# EAGLE design CitizenBoard V3.2 (EAGLE 6.5.0)
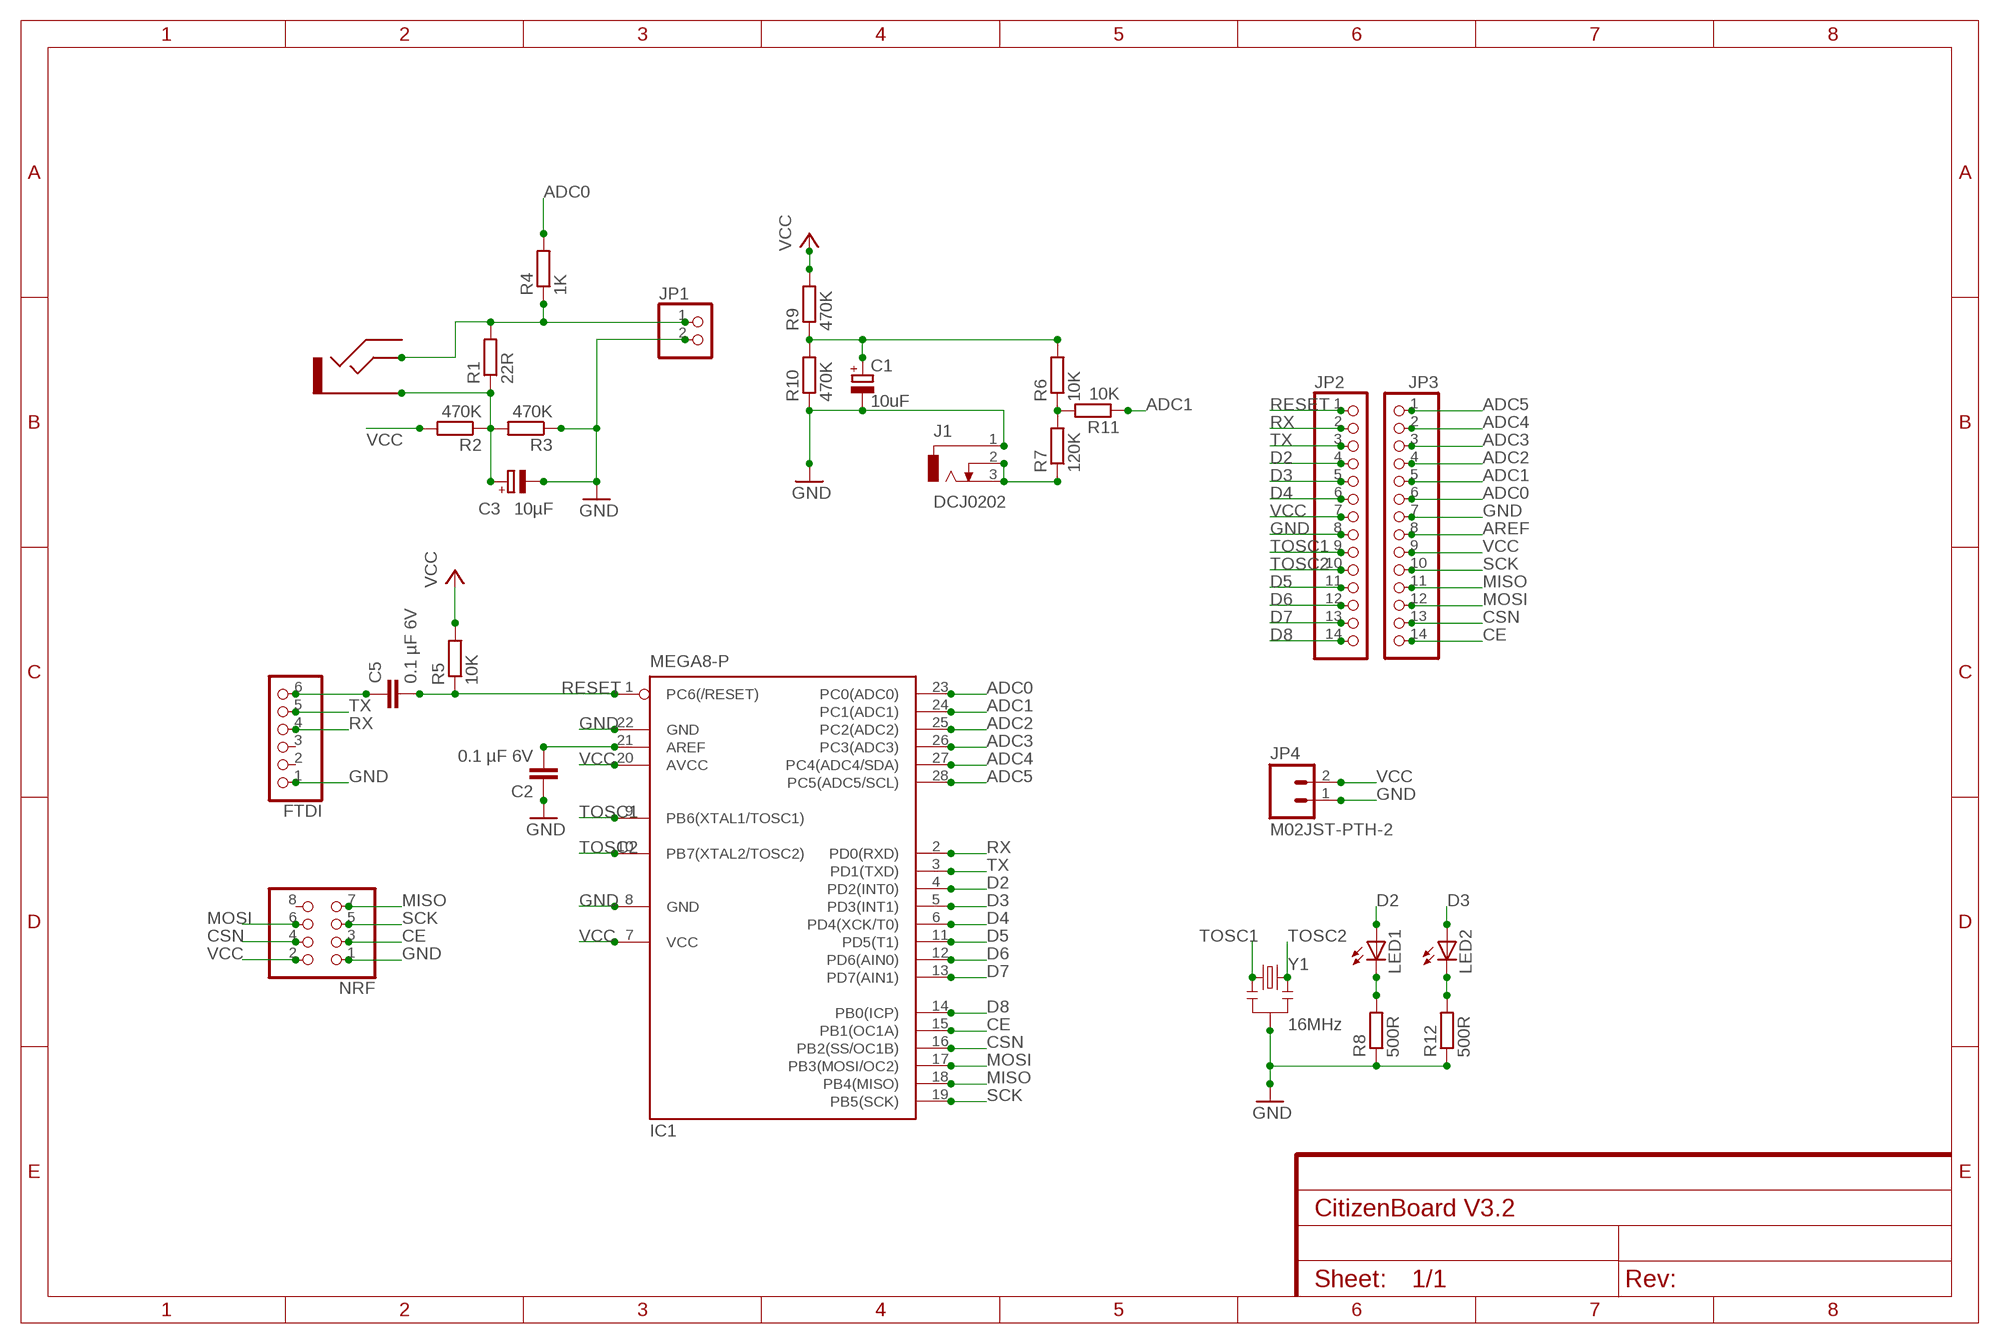
[diagram p0: schematic, sheet 1]

## Parts
C1  10uF  CPOL-EUE2,5-6E  [E2,5-6E]
C2  0.1 µF 6V  C-EU025-024X044  [C025-024X044]
C3  10µF  CPOL-EUE2,5-6E  [E2,5-6E]
C5  0.1 µF 6V  C-EU025-024X044  [C025-024X044]
FTDI  PINHD-1X6  [1X06]
IC1  MEGA8-P  [DIL28-3]
J1  DCJ0202  [DCJ0202]
J2  AUDIO-JACK-3.5  [AUDIO-JACK-3.5]
JP1  PINHD-1X2  [1X02]
JP2  PINHD-1X14  [1X14]
JP3  PINHD-1X14  [1X14]
JP4  M02JST-PTH-2  [JST-2-PTH]
LED1  LED3MM  [LED3MM]
LED2  LED3MM  [LED3MM]
NRF  PINHD-2X4  [2X04]
R1  22R  R-EU_0204/7  [0204/7]
R2  470K  R-EU_0204/7  [0204/7]
R3  470K  R-EU_0204/7  [0204/7]
R4  1K  R-EU_0204/7  [0204/7]
R5  10K  R-EU_0204/7  [0204/7]
R6  10K  R-EU_0204/7  [0204/7]
R7  120K  R-EU_0204/7  [0204/7]
R8  500R  R-EU_0204/7  [0204/7]
R9  470K  R-EU_0204/7  [0204/7]
R10  470K  R-EU_0204/7  [0204/7]
R11  10K  R-EU_0204/7  [0204/7]
R12  500R  R-EU_0204/7  [0204/7]
Y1  16MHz  RESONATORPTH  [RESONATOR-PTH]

## Nets
ADC0: IC1.23(PC0(ADC0)) JP3.6 R4.2
ADC1: IC1.24(PC1(ADC1)) JP3.5 R11.1
ADC2: IC1.25(PC2(ADC2)) JP3.4
ADC3: IC1.26(PC3(ADC3)) JP3.3
ADC4: IC1.27(PC4(ADC4/SDA)) JP3.2
ADC5: IC1.28(PC5(ADC5/SCL)) JP3.1
AREF: C2.2 IC1.21(AREF) JP3.8
CE: IC1.15(PB1(OC1A)) JP3.14 NRF.3
CSN: IC1.16(PB2(SS/OC1B)) JP3.13 NRF.4
D2: IC1.4(PD2(INT0)) JP2.4 LED1.A
D3: IC1.5(PD3(INT1)) JP2.5 LED2.A
D4: IC1.6(PD4(XCK/T0)) JP2.6
D5: IC1.11(PD5(T1)) JP2.11
D6: IC1.12(PD6(AIN0)) JP2.12
D7: IC1.13(PD7(AIN1)) JP2.13
D8: IC1.14(PB0(ICP)) JP2.14
GND: C1.- C2.1 C3.- FTDI.1 IC1.8(GND) IC1.22(GND) J1.1 JP1.2 JP2.8 JP3.7 JP4.1 NRF.1 R3.1 R8.1 R10.1 R12.1 Y1.2
MISO: IC1.18(PB4(MISO)) JP3.11 NRF.7
MOSI: IC1.17(PB3(MOSI/OC2)) JP3.12 NRF.6
N: J2.5T(L) JP1.1 R1.2 R4.1
N$1: R6.1 R7.2 R11.2
N$2: LED2.K(C) R12.2
N$3: C5.1 FTDI.6
N$4: C3.+ J2.1S(GND) R1.1 R2.1 R3.2
N$5: LED1.K(C) R8.2
N$8: J1.2 J1.3 R7.1
N$11: C1.+ R6.2 R9.1 R10.2
RESET: C5.2 IC1.1(PC6(/RESET)) JP2.1 R5.1
RX: FTDI.4 IC1.2(PD0(RXD)) JP2.2
SCK: IC1.19(PB5(SCK)) JP3.10 NRF.5
TOSC1: IC1.9(PB6(XTAL1/TOSC1)) JP2.9 Y1.1
TOSC2: IC1.10(PB7(XTAL2/TOSC2)) JP2.10 Y1.3
TX: FTDI.5 IC1.3(PD1(TXD)) JP2.3
VCC: IC1.7(VCC) IC1.20(AVCC) JP2.7 JP3.9 JP4.2 NRF.2 R2.2 R5.2 R9.2
Unconnected: FTDI.2 FTDI.3 J2.2R(R) NRF.8

## Library data of the parts
C1 C3 = rcl:CPOL-EU: POLARIZED CAPACITOR, European symbol
C2 C5 = rcl:C-EU: CAPACITOR, European symbol
FTDI = pinhead:PINHD-1X6: PIN HEADER
IC1 = atmel:MEGA8-P: MICROCONTROLLER 8 Kbytes FLASH, 1 kbytes SRAM, 512 bytes EEPROM, USART, 4-channel 10 bit ADC, 2-channel 8 bit ADC Pin compatible with Atmega48, ATMega88, ATMega168 Source: avr.lbr; OC_FARNELL: unknown; OC_NEWARK: unknown
J1 = con-jack:DCJ0202: DC POWER JACK Source: DCJ0202.pdf; OC_FARNELL: unknown; OC_NEWARK: unknown
J2 = alex:AUDIO-JACK-3.5: Mouser Jack 3"5
JP1 = pinhead:PINHD-1X2: PIN HEADER
JP2 JP3 = pinhead:PINHD-1X14: PIN HEADER
JP4 = SparkFun-Connectors:M02: Standard 2-pin 0.1" header. Use with - straight break away headers ( PRT-00116) - right angle break away headers (PRT-00553) - swiss pins (PRT-00743) - machine pins (PRT-00117) - female headers (PRT-00115) Molex polarized connector foot print use with: PRT-08233 with associated crimp pins and housings. 2.54_SCREWTERM for use with PRT-10571. 3.5mm Screw Terminal footprints for PRT-08084 5mm Screw Terminal footprints for use with PRT-08433; SKU: PRT-09914
LED1 LED2 = led:LED: LED OSRAM: - CHIPLED LG R971, LG N971, LY N971, LG Q971, LY Q971, LO R971, LY R971 LH N974, LH R974 LS Q976, LO Q976, LY Q976 LO Q996 - Hyper CHIPLED LW Q18S LB Q993, LB Q99A, LB R99A - SideLED LS A670, LO A670, LY A670, LG A670, LP A670 LB A673, LV A673, LT A673, LW A673 LH A674 LY A675 LS A676, LA A676, LO A676, LY A676, LW A676 LS A679, LY A679, LG A679 - Hyper Micro SIDELED® LS Y876, LA Y876, LO Y876, LY Y876 LT Y87S - SmartLED LW L88C, LW L88S LB L89C, LB L89S, LG L890 LS L89K, LO L89K, LY L89K LS L896, LA L896, LO L896, LY L896 - TOPLED LS T670, LO T670, LY T670, LG T670, LP T670 LSG T670, LSP T670, LSY T670, LOP T670, LYG T670 LG T671, LOG T671, LSG T671 LB T673, LV T673, LT T673, LW T673 LH T674 LS T676, LA T676, LO T676, LY T676, LB T676, LH T676, LSB T676, LW T676 LB T67C, LV T67C, LT T67C, LS T67K, LO T67K, LY T67K, LW E67C LS E67B, LA E67B, LO E67B, LY E67B, LB E67C, LV E67C, LT E67C LW T67C LS T679, LY T679, LG T679 LS T770, LO T770, LY T770, LG T770, LP T770 LB T773, LV T773, LT T773, LW T773 LH T774 LS E675, LA E675, LY E675, LS T675 LS T776, LA T776, LO T776, LY T776, LB T776 LHGB T686 LT T68C, LB T68C - Hyper Mini TOPLED® LB M676 - Mini TOPLED Santana® LG M470 LS M47K, LO M47K, LY M47K Source: http://www.osram.convergy.de LUXEON: - LUMILED® LXK2-PW12-R00, LXK2-PW12-S00, LXK2-PW14-U00, LXK2-PW14-V00 LXK2-PM12-R00, LXK2-PM12-S00, LXK2-PM14-U00 LXK2-PE12-Q00, LXK2-PE12-R00, LXK2-PE12-S00, LXK2-PE14-T00, LXK2-PE14-U00 LXK2-PB12-K00, LXK2-PB12-L00, LXK2-PB12-M00, LXK2-PB14-N00, LXK2-PB14-P00, LXK2-PB14-Q00 LXK2-PR12-L00, LXK2-PR12-M00, LXK2-PR14-Q00, LXK2-PR14-R00 LXK2-PD12-Q00, LXK2-PD12-R00, LXK2-PD12-S00 LXK2-PH12-R00, LXK2-PH12-S00 LXK2-PL12-P00, LXK2-PL12-Q00, LXK2-PL12-R00 Source: www.luxeon.com KINGBRIGHT: KA-3528ASYC Source: www.kingbright.com
NRF = pinhead:PINHD-2X4: PIN HEADER
R1-R12 = rcl:R-EU_: RESISTOR, European symbol
Y1 = SparkFun-FreqCtrl:RESONATOR: Resonator Small SMD resonator. Used, eg, on the Arduino Pro/ Pro Mini boards. 8MHz- XTAL-08895 16MHz- XTAL-08900

## Board
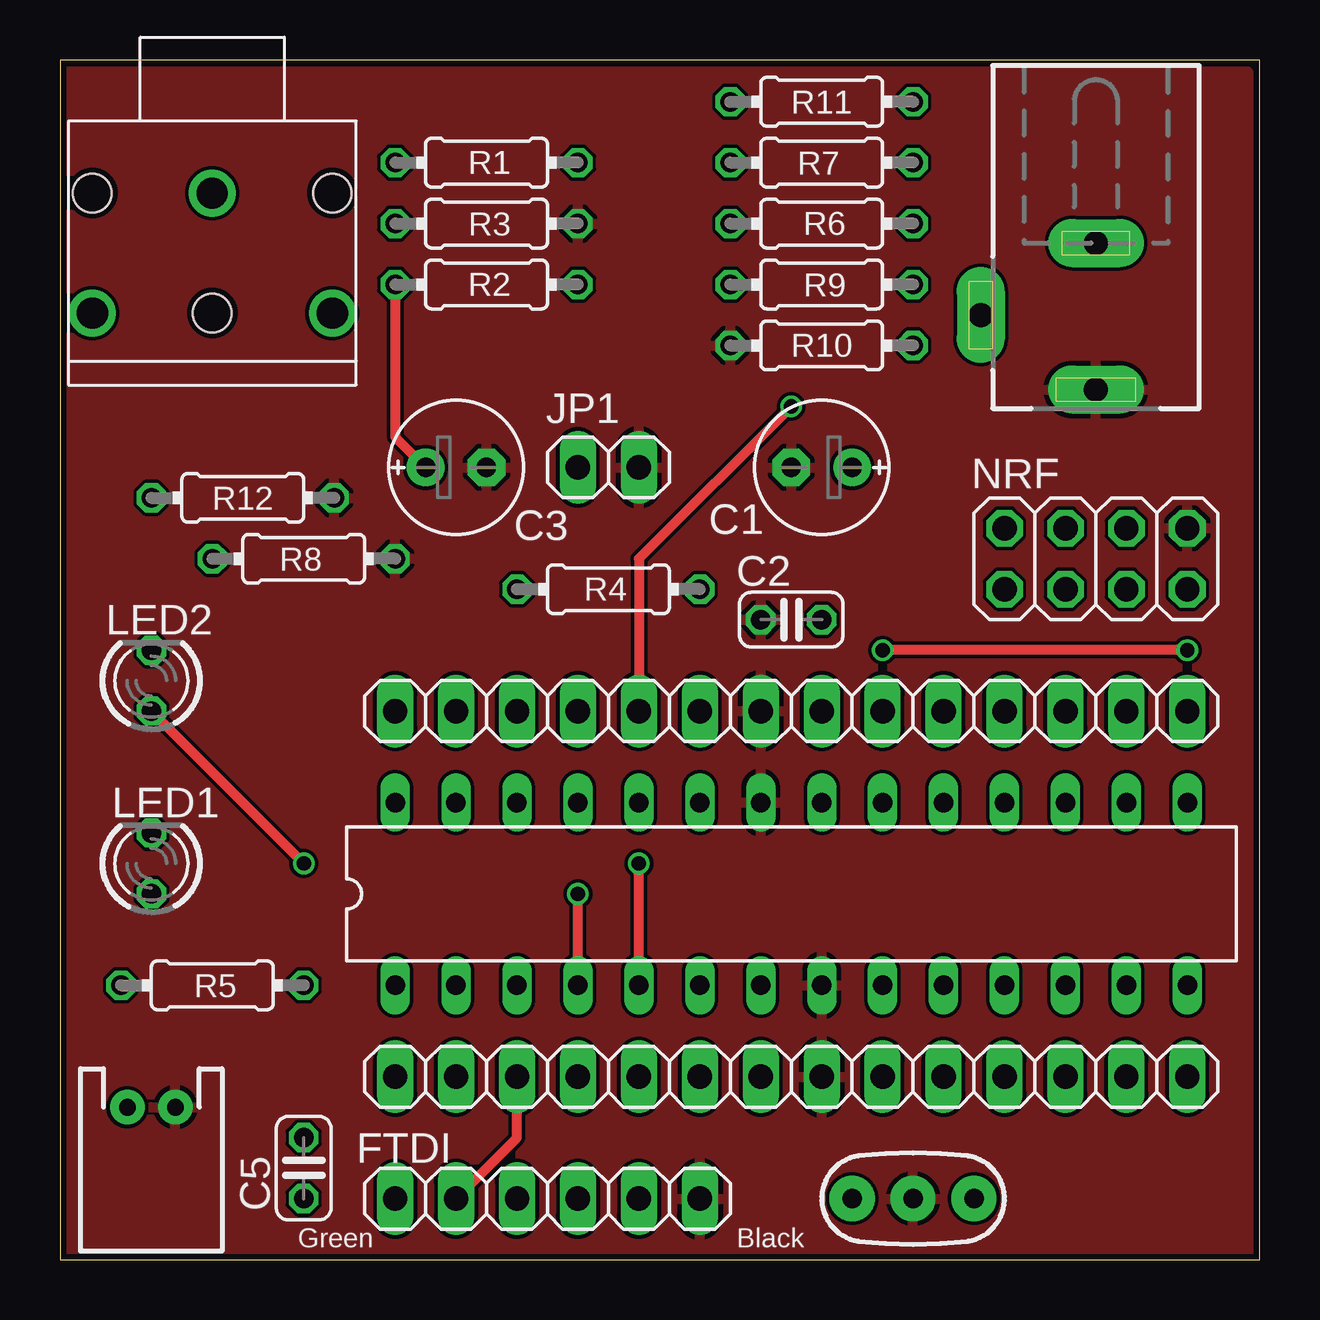
[diagram p1: board, top side]
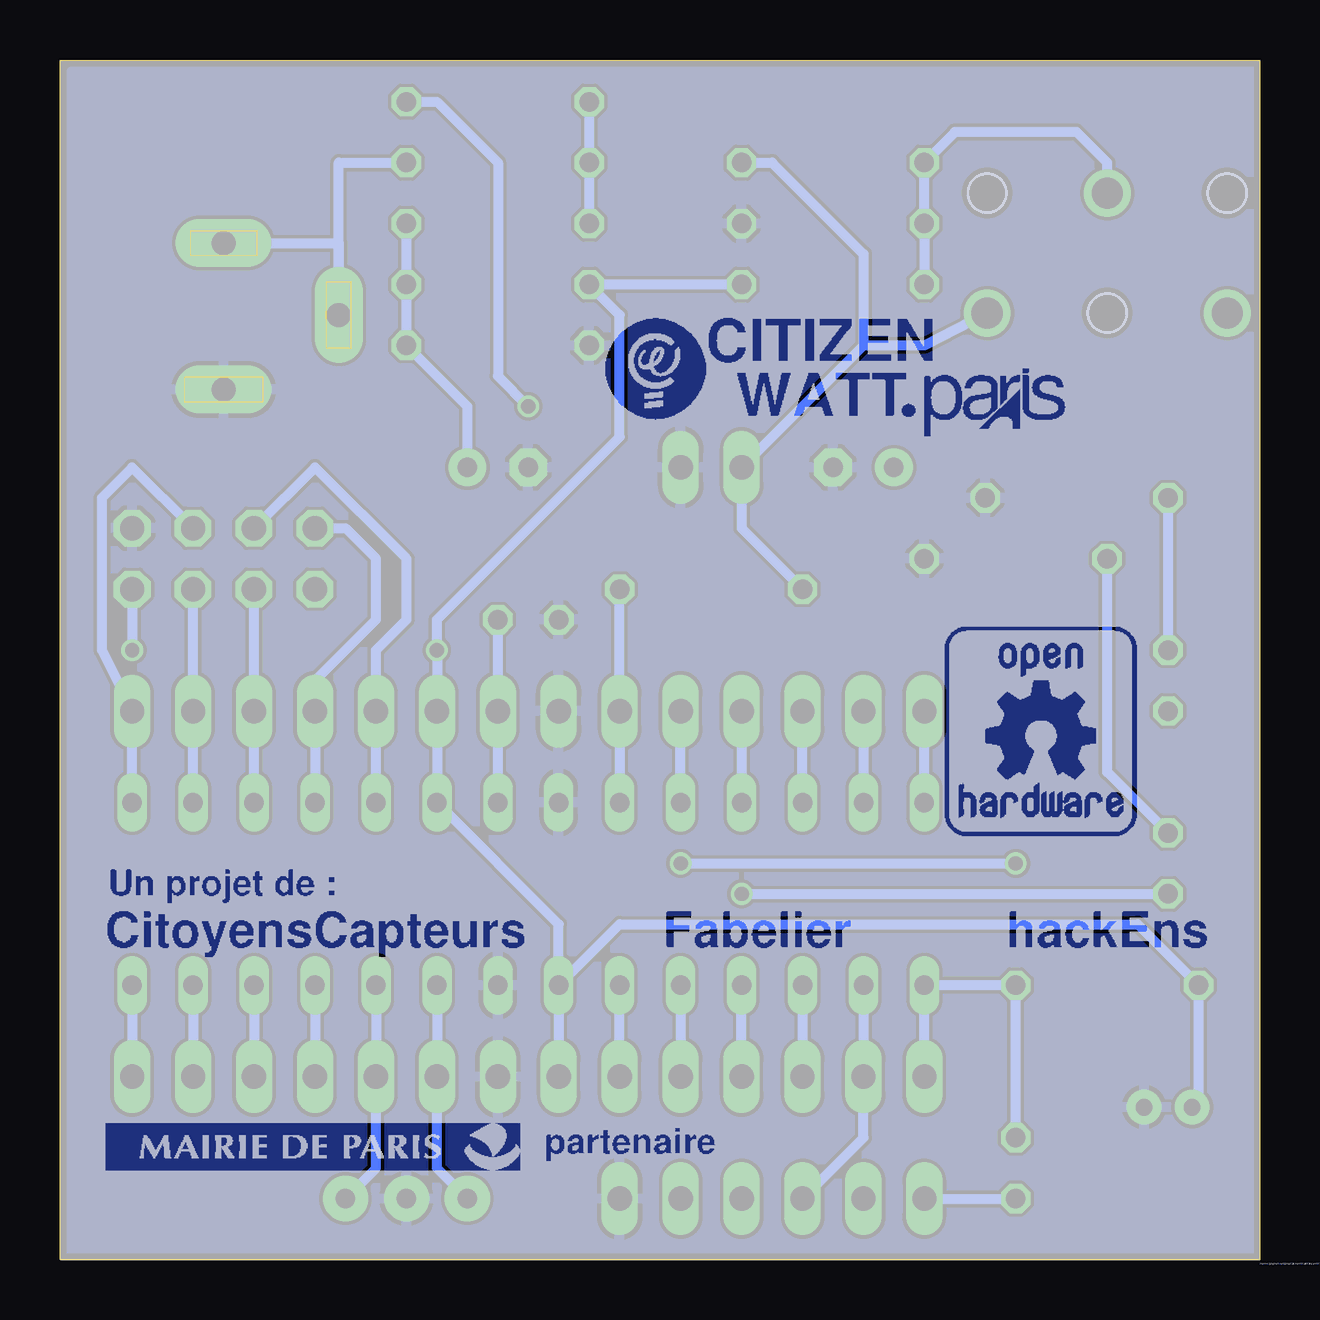
[diagram p2: board, bottom side, seen from below]

Size 50 x 50 mm. Coordinates in mm from the lower left corner, seen from the top.
Outline: 0,0 50,0 50,50 0,50 0,0
Copper layers (1*16): Top 0.018mm / dielectric 1.55mm / Bottom 0.018mm
Design rules "eC_2Layer_PClass6_BaseCopperO18_eCDefault": minimum track width 0.15mm, minimum drill 0.35mm, track to track 0.15mm, track to pad 0.15mm, pad to pad 0.15mm, via to via 0.15mm, smd to smd 0mil, copper to edge 0.25mm, drill to drill 0.35mm, minimum pad ring 0.175mm, minimum via ring 0.125mm, stop-mask expansion 0mil, vias tented up to drill 0.45mm, thermal gap 0.2mm

### Footprints (pad centres in the part's own frame; a part is rotated, then mirrored left to right if it is on the bottom)
E2,5-6E = drill 0.813 pad 1.575: + -1.27,0 | drill 0.813 pad 1.575 octagon: - 1.27,0
C025-024X044 = drill 0.813 octagon: 1 -1.27,0; 2 1.27,0
1X06 = drill 1.016 long: 1 -6.35,0; 2 -3.81,0; 3 -1.27,0; 4 1.27,0; 5 3.81,0; 6 6.35,0
DIL28-3 = drill 0.813 long: 1 -16.51,-3.81; 2 -13.97,-3.81; 3 -11.43,-3.81; 4 -8.89,-3.81; 5 -6.35,-3.81; 6 -3.81,-3.81; 7 -1.27,-3.81; 8 1.27,-3.81; 9 3.81,-3.81; 10 6.35,-3.81; 11 8.89,-3.81; 12 11.43,-3.81; 13 13.97,-3.81; 14 16.51,-3.81; 15 16.51,3.81; 16 13.97,3.81; 17 11.43,3.81; 18 8.89,3.81; 19 6.35,3.81; 20 3.81,3.81; 21 1.27,3.81; 22 -1.27,3.81; 23 -3.81,3.81; 24 -6.35,3.81; 25 -8.89,3.81; 26 -11.43,3.81; 27 -13.97,3.81; 28 -16.51,3.81
DCJ0202 = drill 1 pad 2 long: 1 0,3.1; 2 4.8,0; 3 0,-3
AUDIO-JACK-3.5 = drill 1.3: 1S 0,0; 2R 5,-5; 5T 5,5 | hole 1.6: 0,-5; 5,0; 0,5
1X02 = drill 1.016 long: 1 -1.27,0; 2 1.27,0
1X14 = drill 1.016 long: 1 -16.51,0; 2 -13.97,0; 3 -11.43,0; 4 -8.89,0; 5 -6.35,0; 6 -3.81,0; 7 -1.27,0; 8 1.27,0; 9 3.81,0; 10 6.35,0; 11 8.89,0; 12 11.43,0; 13 13.97,0; 14 16.51,0
JST-2-PTH = drill 0.7 pad 1.448: 1 -1,0; 2 1,0
LED3MM = drill 0.813 octagon: A -1.27,0; K 1.27,0
2X04 = drill 1.016 octagon: 1 -3.81,-1.27; 2 -3.81,1.27; 3 -1.27,-1.27; 4 -1.27,1.27; 5 1.27,-1.27; 6 1.27,1.27; 7 3.81,-1.27; 8 3.81,1.27
0204/7 = drill 0.813 octagon: 1 -3.81,0; 2 3.81,0
RESONATOR-PTH = drill 0.8 pad 1.88: 1 -2.54,0; 2 0,0; 3 2.54,0

### Placement (x,y rotation side)
C1  31.75,33.02 180 top
C2  30.48,26.67 0 top
C3  16.51,33.02 0 top
C5  10.16,3.81 90 top
FTDI  20.32,2.54 180 top
IC1  30.48,15.24 0 top
J1  43.18,39.37 180 top
J2  6.35,44.45 270 top
JP1  22.86,33.02 0 top
JP2  30.48,7.62 0 top
JP3  30.48,22.86 0 top
JP4  3.81,6.35 180 top
LED1  3.81,16.51 90 top
LED2  3.81,24.13 90 top
NRF  43.18,29.21 180 top
R1  17.78,45.72 0 top
R2  17.78,40.64 0 top
R3  17.78,43.18 180 top
R4  22.86,27.94 0 top
R5  6.35,11.43 180 top
R6  31.75,43.18 0 top
R7  31.75,45.72 180 top
R8  10.16,29.21 180 top
R9  31.75,40.64 180 top
R10  31.75,38.1 0 top
R11  31.75,48.26 180 top
R12  7.62,31.75 180 top
Y1  35.56,2.54 0 top

### Tracks (layer width: path | path; a pad name or v marks a point on that pad's centre or on a via)
ADC0
  Bottom 0.406: IC1.23 JP3.6 R4.2
ADC1  (via drill 0.6)
  Top 0.406: v30.48,35.56 24.13,29.21 JP3.5
  Bottom 0.406: IC1.24 JP3.5 | R11.1 34.29,48.26 31.75,45.72 31.75,36.83 v30.48,35.56
ADC2
  Bottom 0.406: JP3.4 IC1.25
ADC3
  Bottom 0.406: IC1.26 JP3.3
ADC4
  Bottom 0.406: JP3.2 IC1.27
ADC5
  Bottom 0.406: IC1.28 JP3.1
AREF
  Bottom 0.406: IC1.21 JP3.8 C2.2
CE
  Bottom 0.406: IC1.15 JP3.14 48.26,25.4 48.26,31.75 46.99,33.02 NRF.3
CSN
  Bottom 0.406: IC1.16 JP3.13 NRF.4
D2  (via drill 0.6)
  Top 0.406: IC1.4 v21.59,15.24
  Bottom 0.406: JP2.4 IC1.4 | v21.59,15.24 LED1.A
D3  (via drill 0.6)
  Top 0.406: IC1.5 v24.13,16.51 | v10.16,16.51 LED2.A
  Bottom 0.406: IC1.5 JP2.5 | v24.13,16.51 v10.16,16.51
D4
  Bottom 0.406: JP2.6 IC1.6
D5
  Bottom 0.406: IC1.11 JP2.11
D6
  Bottom 0.406: IC1.12 JP2.12
D7
  Bottom 0.406: IC1.13 JP2.13
D8
  Bottom 0.406: IC1.14 JP2.14
GND
  pour Bottom: 0,49.53 49.53,49.53 49.53,0 0,0
  pour Top: 0,49.53 49.53,49.53 49.53,0 0,0
MISO
  Bottom 0.406: IC1.18 JP3.11 39.37,24.13 36.83,26.67 36.83,29.21 38.1,30.48 NRF.7
MOSI
  Bottom 0.406: IC1.17 JP3.12 NRF.6
N
  Bottom 0.406: R1.2 20.32,45.72 16.51,41.91 16.51,38.1 | 16.51,38.1 JP1.1 21.59,30.48 R4.1 | J2.5T 13.97,38.1 16.51,38.1
N$1
  Bottom 0.406: R11.2 R7.2 R6.1
N$2
  Bottom 0.406: LED2.K R12.2
N$3
  Bottom 0.406: FTDI.6 C5.1
N$4
  Top 0.406: R2.1 13.97,34.29 C3.+
  Bottom 0.406: R2.1 R3.2 R1.1 12.7,46.99 7.62,46.99 6.35,45.72 J2.1S
N$5
  Bottom 0.406: LED1.K 6.35,20.32 R8.2
N$8
  Bottom 0.406: J1.3 38.38,42.37 J1.2 38.38,45.72 R7.1
N$11
  Bottom 0.406: R6.2 R9.1 R10.2 33.02,35.56 C1.+
RESET
  Bottom 0.406: C5.2 R5.1 IC1.1 JP2.1
RX
  Bottom 0.406: IC1.2 JP2.2 16.51,5.08 FTDI.4
SCK
  Bottom 0.406: IC1.19 JP3.10 36.83,25.4 35.56,26.67 35.56,29.21 39.37,33.02 NRF.5
TOSC1
  Bottom 0.406: IC1.9 JP2.9 34.29,3.81 Y1.1
TOSC2
  Bottom 0.406: IC1.10 JP2.10 36.83,3.81 Y1.3
TX
  Top 0.406: FTDI.5 19.05,5.08 JP2.3
  Bottom 0.406: IC1.3 JP2.3
VCC  (via drill 0.6)
  Top 0.406: v46.99,25.4 v34.29,25.4
  Bottom 0.406: IC1.7 JP2.7 | IC1.7 26.67,13.97 5.08,13.97 R5.2 2.54,6.62 JP4.2 | IC1.7 29.21,13.97 IC1.20 JP3.9 v34.29,25.4 34.29,26.67 26.67,34.29 26.67,39.37 R9.2 R2.2 | NRF.2 v46.99,25.4

### Text on the board
bPlace: /home/phyks/hackEns/CitizenWatt/CitizenWatt-sensor/Hardware/CitizenBoard/silkscreen3bold.bmp
tNames: Green | Black